# EAGLE schematic Stromlaufplan_3D-Drucker-Dominik_und_Sami_v5 (EAGLE 9.5.2)
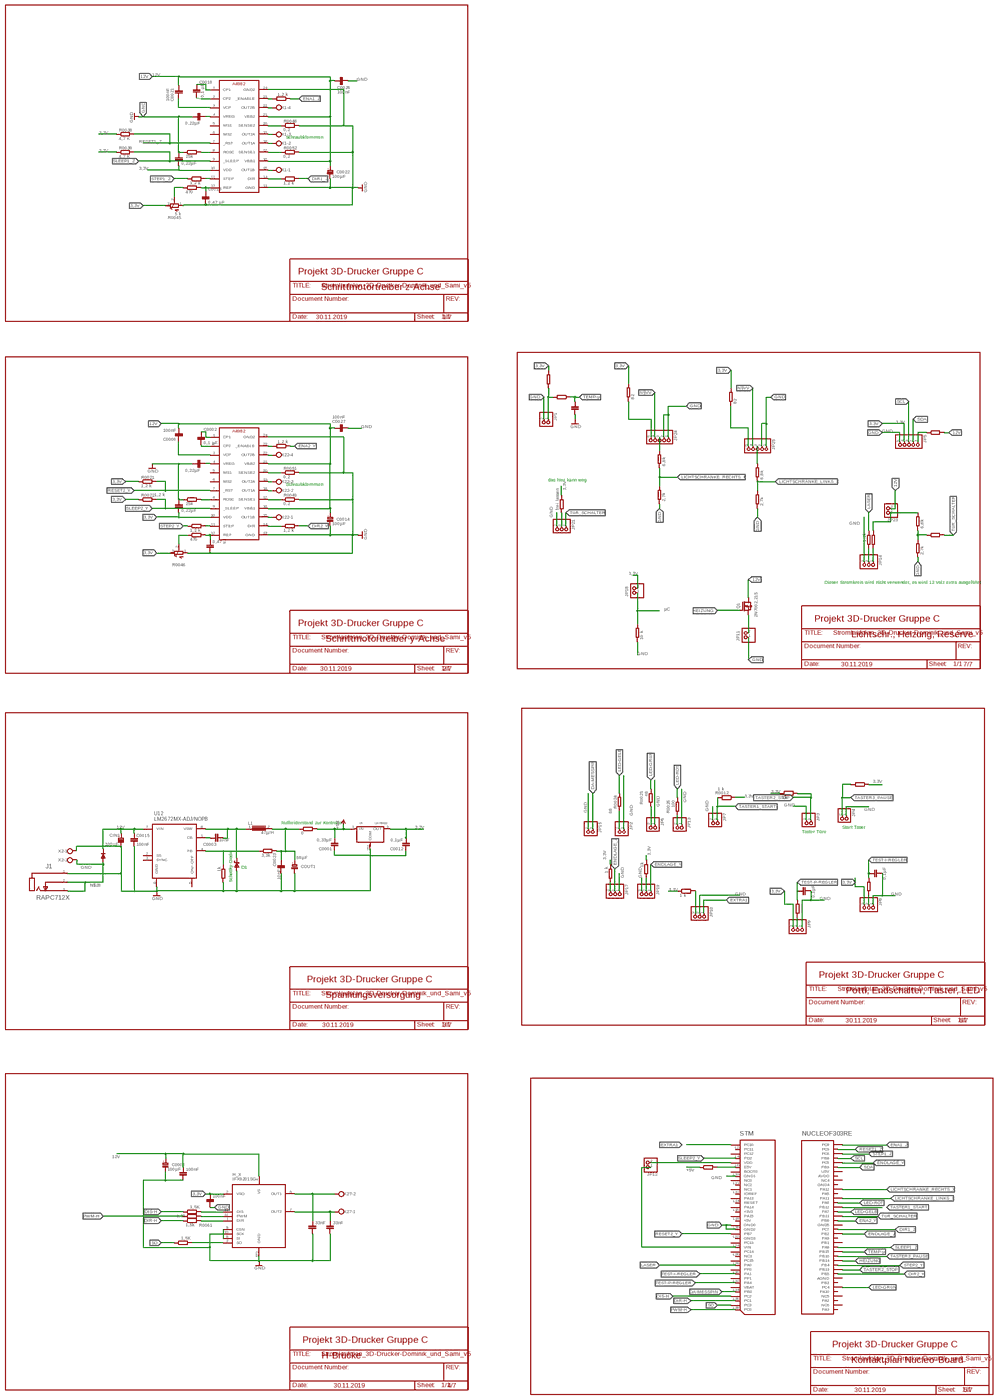
[diagram p0: schematic, sheet 1, overview]
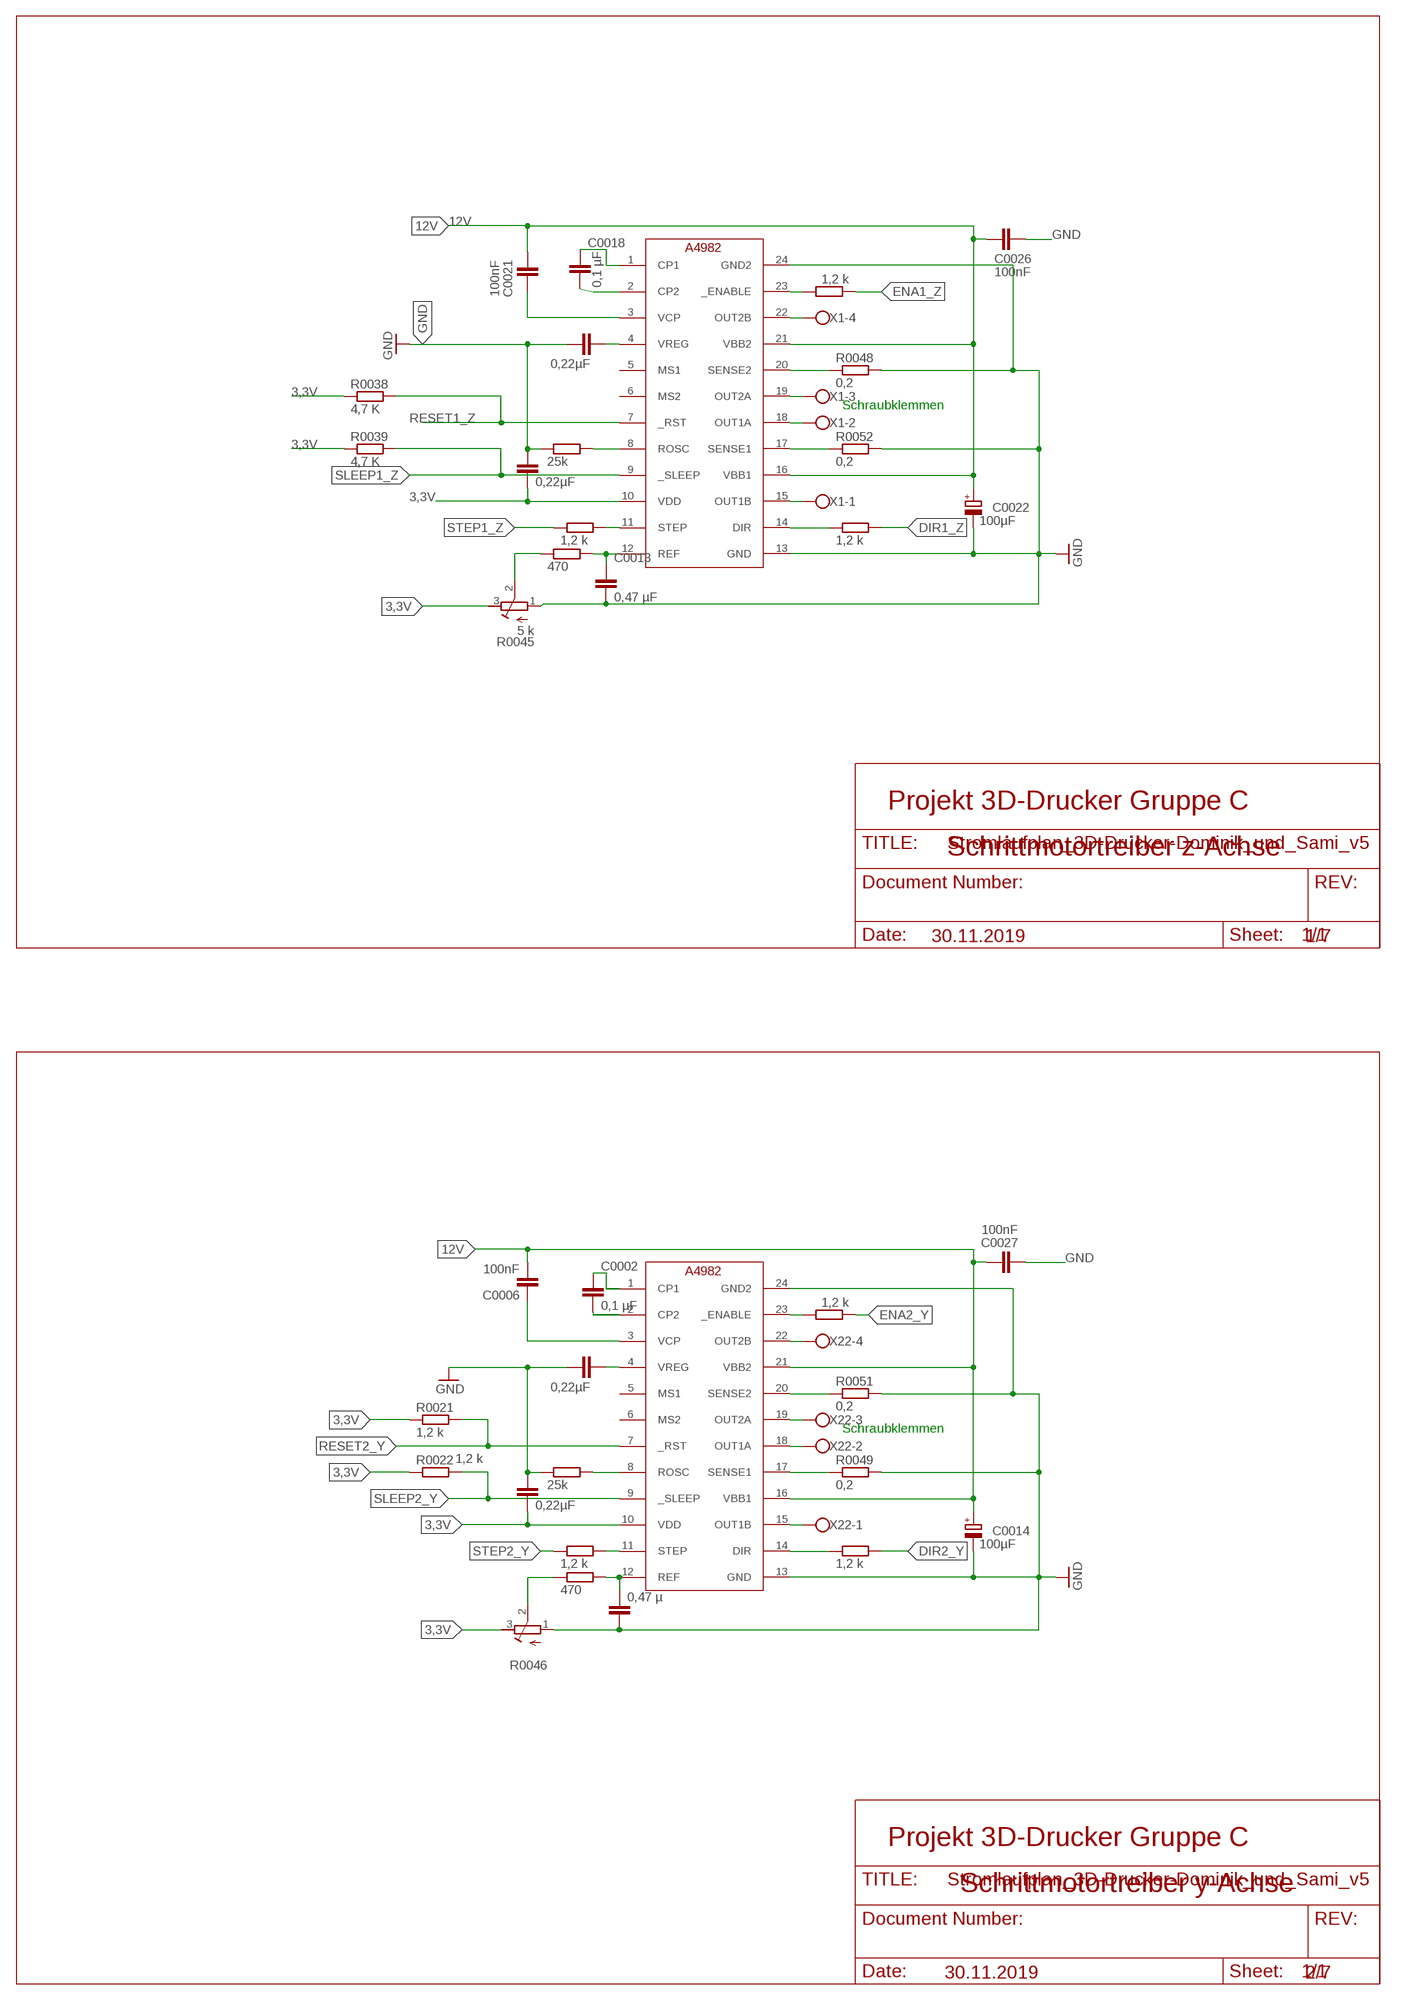
[diagram p1: schematic, sheet 1, part 1 of 4]
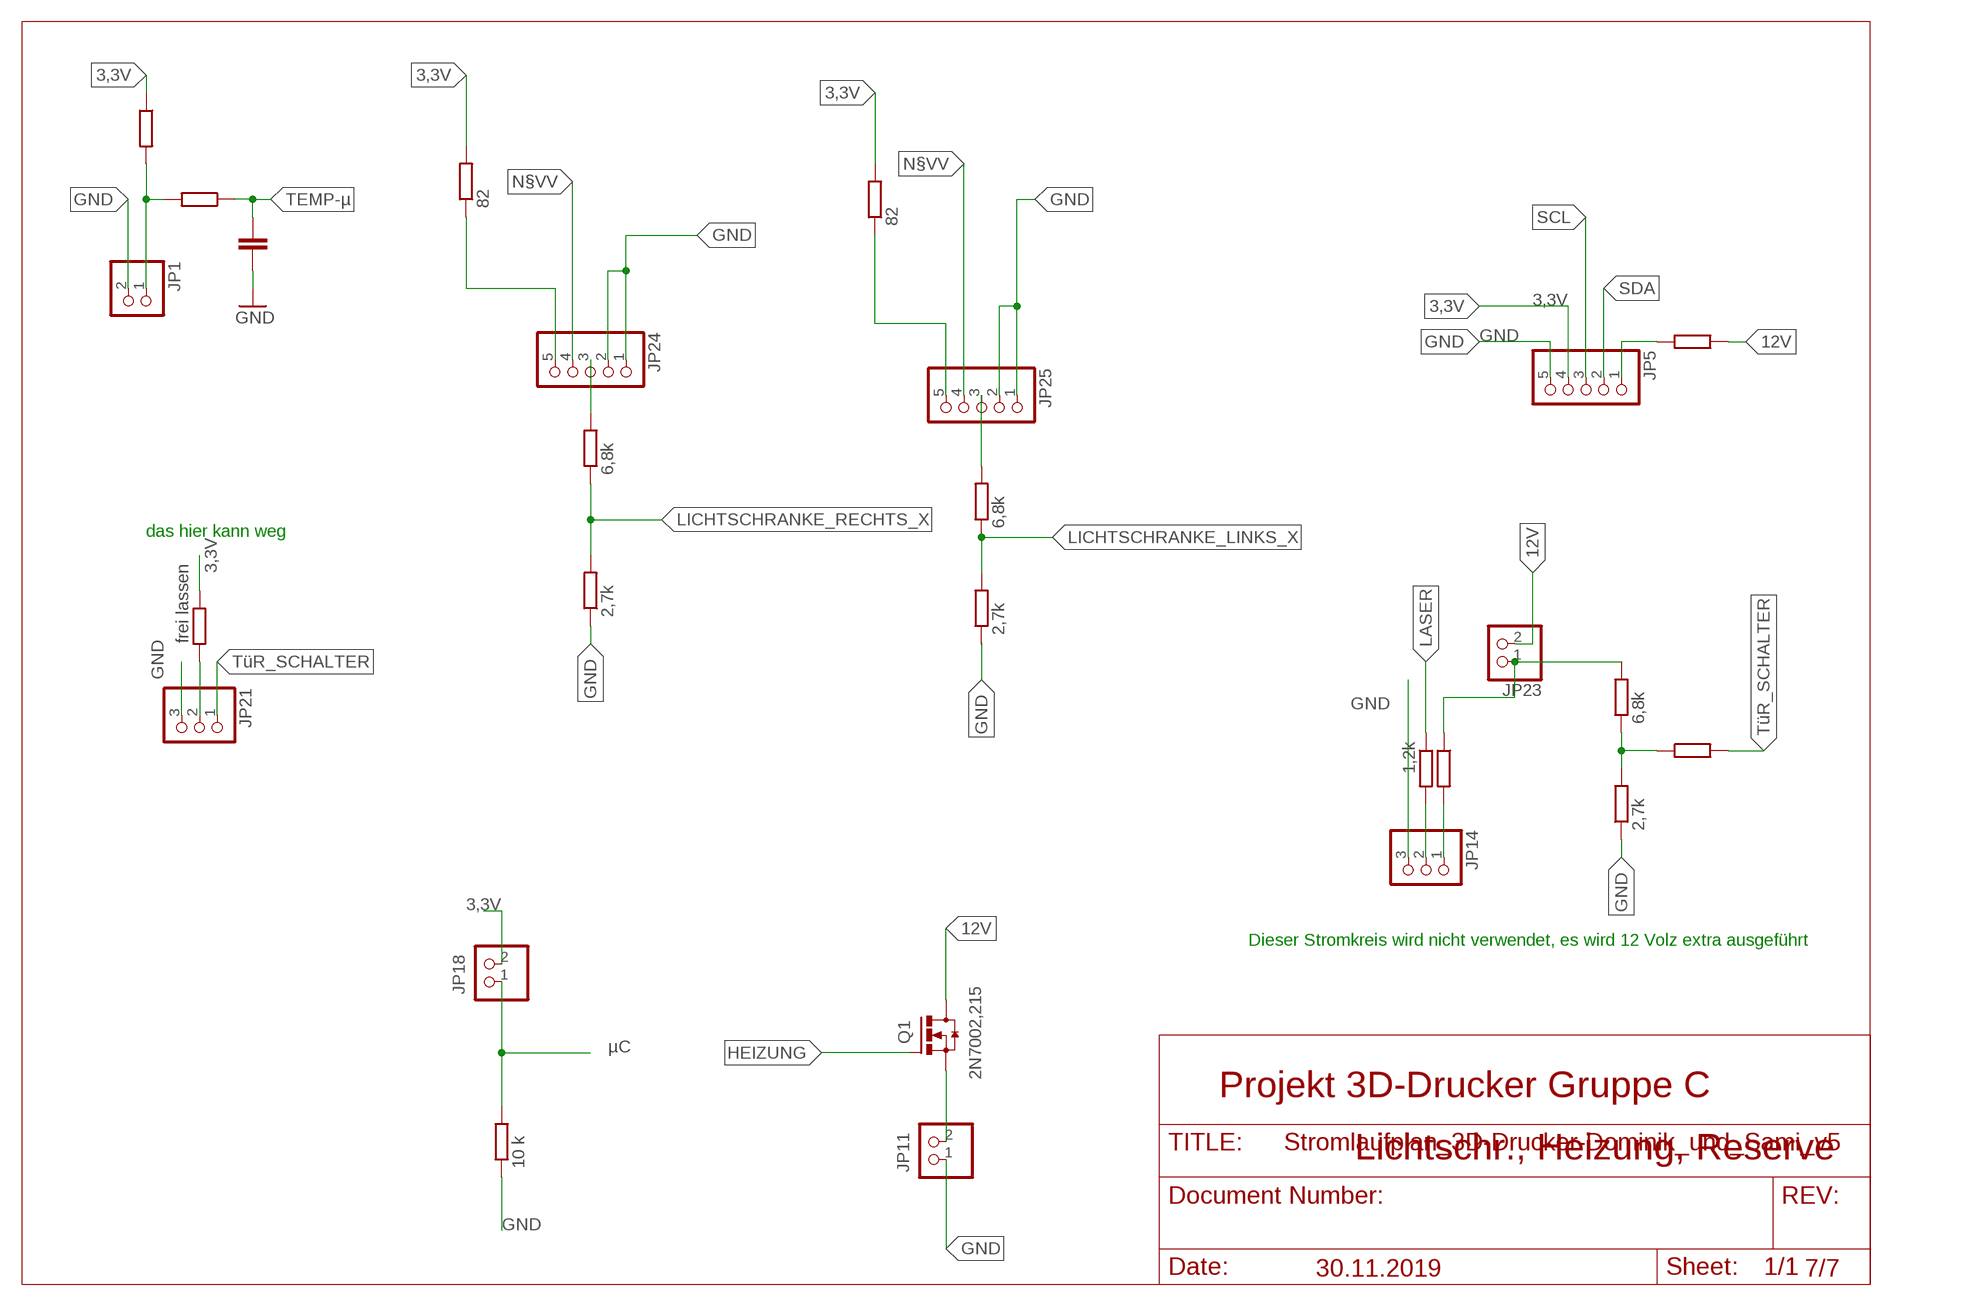
[diagram p2: schematic, sheet 1, part 2 of 4]
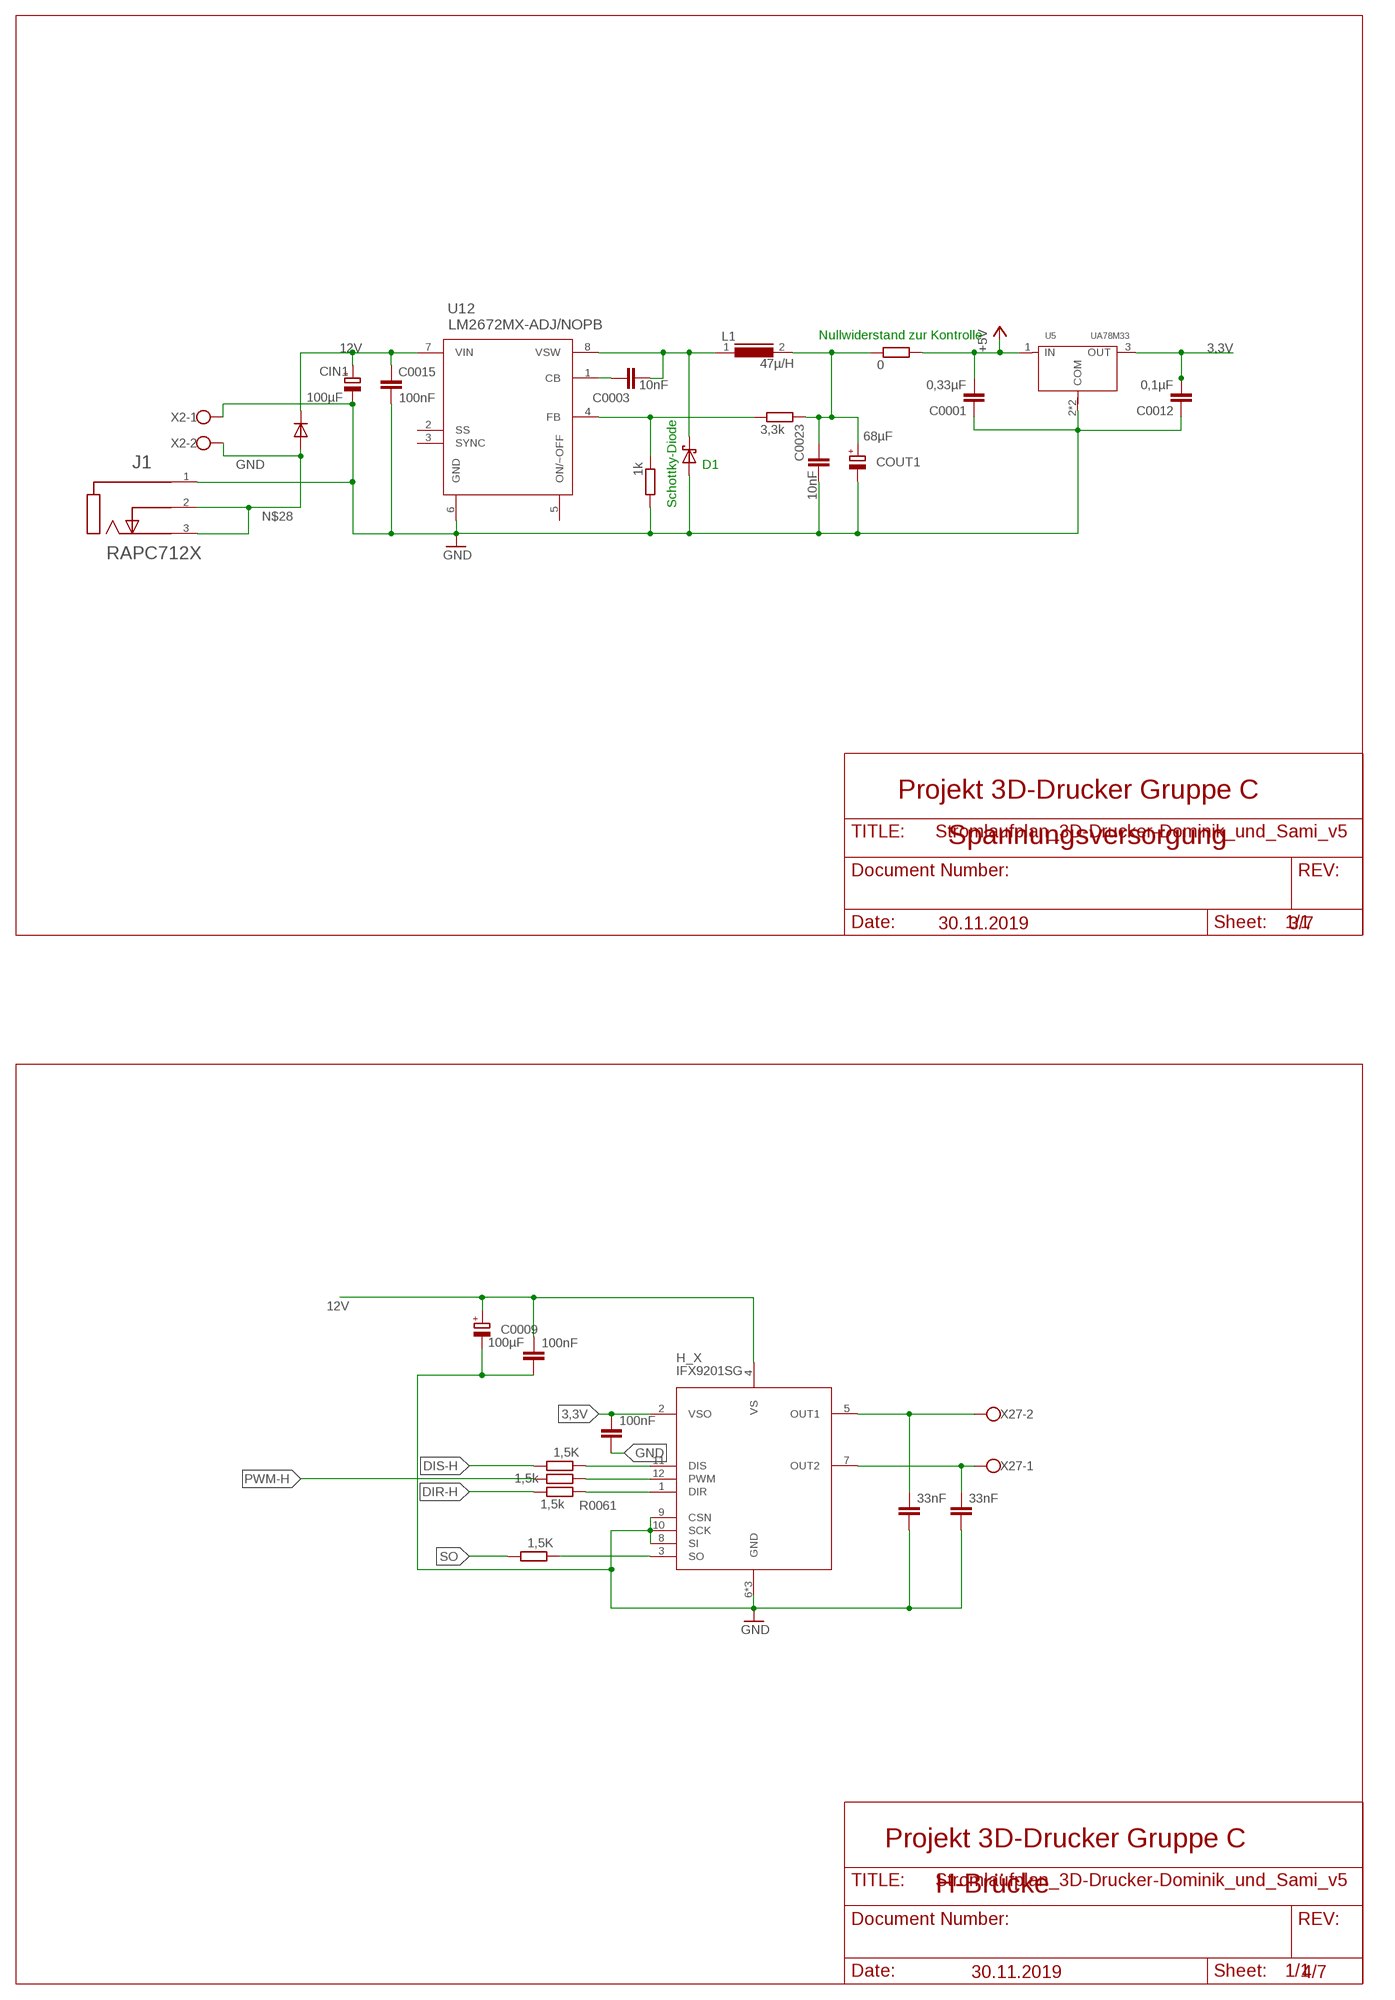
[diagram p3: schematic, sheet 1, part 3 of 4]
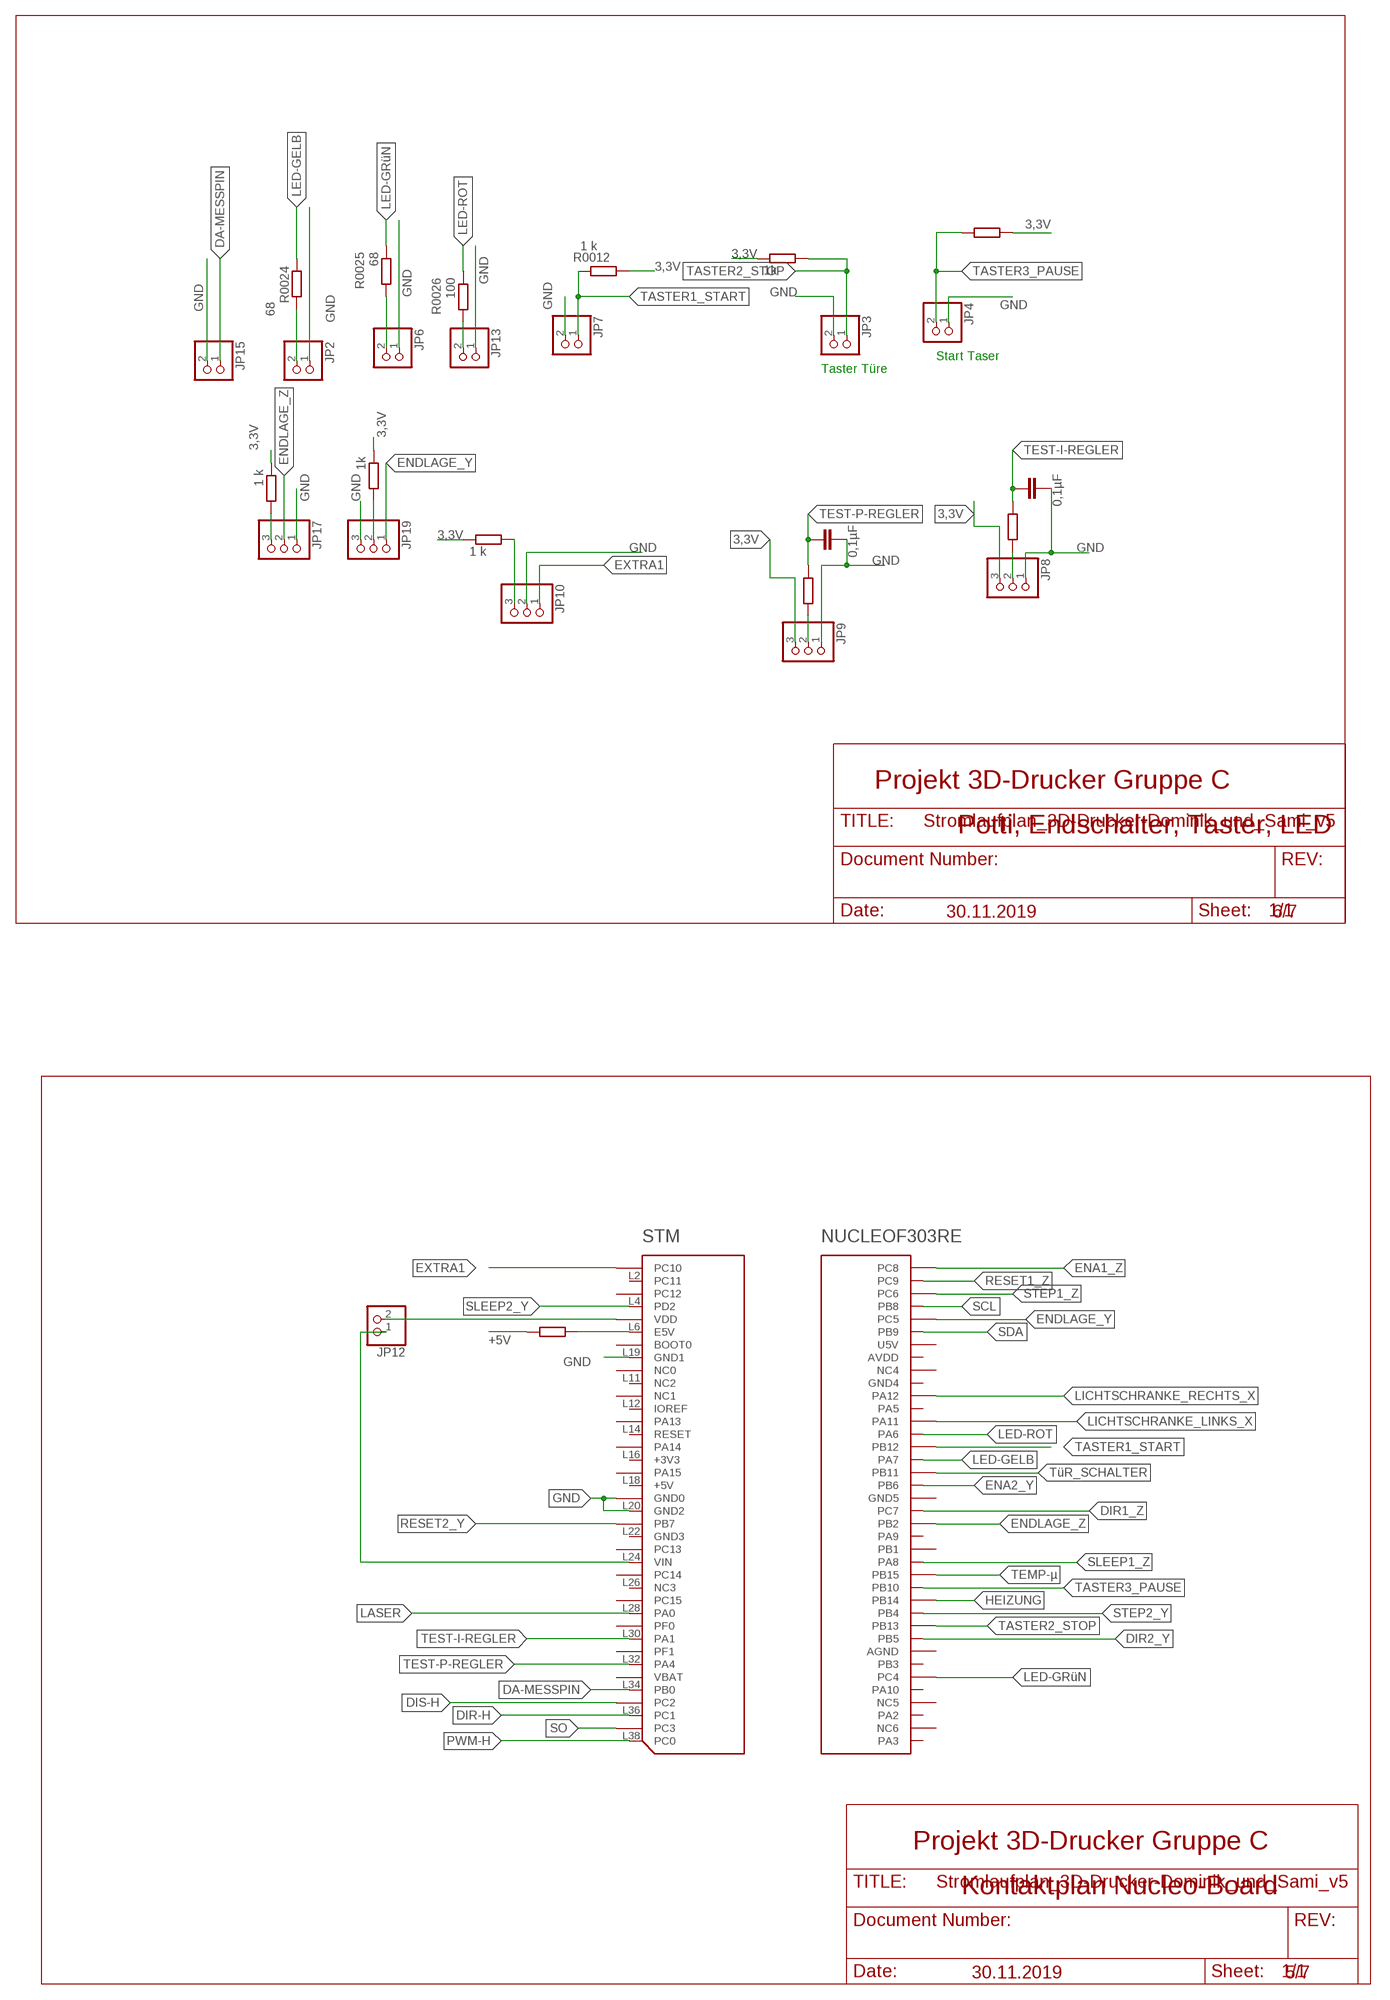
[diagram p4: schematic, sheet 1, part 4 of 4]

## Parts
A4982_Y  A4982_STEPDRIVER  [TSSOP24]
A4982_Y1  A4982_STEPDRIVER  [TSSOP24]
C0001  0,33µF  C-EUC0603  [C0603]
C0002  0,1 µF  C-EUC0603  [C0603]
C0003  10nF  C-EUC0603  [C0603]
C0004  0,22µF  C-EUC0603  [C0603]
C0005  0,22µF  C-EUC0603  [C0603]
C0006  100nF  C-EUC0603  [C0603]
C0007  33nF  C-EUC0805  [C0805]
C0008  33nF  C-EUC0805  [C0805]
C0009  100µF  CPOL-EUUD-8X10  [UD-8X10_NICHICON]
C0010  0,47 µ  C-EUC0805  [C0805]
C0011  C-EUC0805  [C0805]
C0012  0,1µF  C-EUC0603  [C0603]
C0013  0,47 µF  C-EUC0603  [C0603]
C0014  100µF  CPOL-EUUD-8X10  [UD-8X10_NICHICON]
C0015  100nF  C-EUC0603  [C0603]
C0016  100nF  C-EUC0805  [C0805]
C0018  0,1 µF  C-EUC0603  [C0603]
C0019  0,22µF  C-EUC0603  [C0603]
C0020  0,22µF  C-EUC0603  [C0603]
C0021  100nF  C-EUC0603  [C0603]
C0022  100µF  CPOL-EUUD-8X10  [UD-8X10_NICHICON]
C0023  10nF  C-EUC0603  [C0603]
C0024  0,1µF  C-EUC0603  [C0603]
C0025  0,1µF  C-EUC0603  [C0603]
C0026  100nF  C-EUC0603  [C0603]
C0027  100nF  C-EUC0603  [C0603]
C0041  100nF  C-EUC0805  [C0805]
CIN1  100µF  CPOL-EU140CLH-1010  [140CLH-1010]
COUT1  68µF  CPOL-EU140CLH-1010  [140CLH-1010]
D1  1N5819HW-7-F  [SOD-123_MINI-SMA]
D12  MURS360BT3G  [SMB]
H_X  IFX9201SG  [BSOP-12]
J1  RAPC712X  [SWC_RAPC712X]
JP1  PINHD-1X2  [1X02]
JP2  PINHD-1X2  [1X02]
JP3  PINHD-1X2  [1X02]
JP4  PINHD-1X2  [1X02]
JP5  PINHD-1X5  [1X05]
JP6  PINHD-1X2  [1X02]
JP7  PINHD-1X2  [1X02]
JP8  PINHD-1X3  [1X03]
JP9  PINHD-1X3  [1X03]
JP10  PINHD-1X3  [1X03]
JP11  PINHD-1X2  [1X02]
JP12  PINHD-1X2  [1X02]
JP13  PINHD-1X2  [1X02]
JP14  PINHD-1X3  [1X03]
JP15  PINHD-1X2  [1X02]
JP17  PINHD-1X3  [1X03]
JP18  PINHD-1X2  [1X02]
JP19  PINHD-1X3  [1X03]
JP21  PINHD-1X3  [1X03]
JP23  PINHD-1X2  [1X02]
JP24  PINHD-1X5  [1X05]
JP25  PINHD-1X5  [1X05]
L1  47µ/H  SRR1240-680M  [INDUCTOR]
Q1  2N7002,215  [SOT23-3]
R0001  1,5K  R-EU_R0603  [R0603]
R0002  6,8k  R-EU_R0603  [R0603]
R0003  1k  R-EU_R0603  [R0603]
R0004  2,7k  R-EU_R0603  [R0603]
R0005  6,8k  R-EU_R0603  [R0603]
R0006  25k  R-EU_R0603  [R0603]
R0007  10 k  R-EU_R0603  [R0603]
R0008  R-EU_R0603  [R0603]
R0009  1,2 k  R-EU_R0603  [R0603]
R0010  1,2 k  R-EU_R0603  [R0603]
R0011  1,2 k  R-EU_R0603  [R0603]
R0012  1 k  R-EU_R0603  [R0603]
R0013  1k  R-EU_R0603  [R0603]
R0014  R-EU_R0603  [R0603]
R0015  1 k  R-EU_R0603  [R0603]
R0016  R-EU_R0603  [R0603]
R0017  R-EU_R0603  [R0603]
R0018  frei lassen  R-EU_R0603  [R0603]
R0019  25k  R-EU_R0603  [R0603]
R0020  R-EU_R0603  [R0603]
R0021  1,2 k  R-EU_R0603  [R0603]
R0022  1,2 k  R-EU_R0603  [R0603]
R0023  470  R-EU_R0603  [R0603]
R0024  68  R-EU_R0603  [R0603]
R0025  68  R-EU_R0603  [R0603]
R0026  100  R-EU_R0603  [R0603]
R0027  R-EU_R0603  [R0603]
R0028  2,7k  R-EU_R0603  [R0603]
R0029  82  R-EU_R0603  [R0603]
R0030  R-EU_R0603  [R0603]
R0031  R-EU_R0603  [R0603]
R0032  82  R-EU_R0603  [R0603]
R0033  1 k  R-EU_R0603  [R0603]
R0034  1,2 k  R-EU_R0603  [R0603]
R0035  1,2 k  R-EU_R0603  [R0603]
R0036  1,2 k  R-EU_R0603  [R0603]
R0037  470  R-EU_R0603  [R0603]
R0038  4,7 K  R-EU_R0603  [R0603]
R0039  4,7 K  R-EU_R0603  [R0603]
R0042  1,2k  R-EU_R0603  [R0603]
R0043  6,8k  R-EU_R0603  [R0603]
R0044  2,7k  R-EU_R0603  [R0603]
R0045  5 k  R-TRIMM3296Y  [RTRIM3296Y]
R0046  R-TRIMM3296Y  [RTRIM3296Y]
R0048  0,2  R-EU_R2512  [R2512]
R0049  0,2  R-EU_R2512  [R2512]
R0051  0,2  R-EU_R2512  [R2512]
R0052  0,2  R-EU_R2512  [R2512]
R0053  R-EU_R0603  [R0603]
R0061  1,5k  R-EU_R0603  [R0603]
R0062  1,5k  R-EU_R0603  [R0603]
R0063  1,5K  R-EU_R0603  [R0603]
STM  NUCLEOF303RE  [DIL40]
TEST_R  0  R-EU_R0603  [R0603]
TEST_R2  3,3k  R-EU_R0603  [R0603]
TEST_R3  1k  R-EU_R0603  [R0603]
U5  UA78M33  [SOT-223]
U12  LM2672MX-ADJ/NOPB  [SOIC-8]
X1  SCHRAUBKLEMME_4X  [W237-4]
X2  SCHRAUBKLEMME_2X  [W237-102]
X22  SCHRAUBKLEMME_4X  [W237-4]
X27  SCHRAUBKLEMME_2X  [W237-102]

## Nets
3,3V [3,3V]: A4982_Y1.10(VDD) A4982_Y.10(VDD) C0005.1 C0012.2 C0016.1 C0020.1 H_X.2(VSO) JP5.4 JP8.3 JP9.3 JP18.2 R0003.1 R0008.1 R0012.1 R0013.1 R0014.1 R0015.1 R0018.1 R0021.1 R0022.1 R0029.2 R0032.2 R0033.1 R0038.1 R0039.1 R0045.3(E) R0046.3(E) U5.3(OUT)
12V [12V]: A4982_Y1.16(VBB1) A4982_Y1.21(VBB2) A4982_Y.16(VBB1) A4982_Y.21(VBB2) C0006.2 C0009.+ C0014.+ C0015.2 C0021.2 C0022.+ C0026.2 C0027.1 C0041.1 CIN1.+ D12.1 H_X.4(VS) JP14.1 JP23.2 Q1.3(D) R0016.2 R0030.2 U12.7(VIN)
+5V [5V]: C0001.2 R0027.1 TEST_R.2 U5.1(IN)
DA-MESSPIN: JP15.1 STM.L34(PB0)
DIR1_Z: R0036.2 STM.R19(PC7)
DIR2_Y: R0011.2 STM.R29(PB5)
DIR-H: R0061.1 STM.L36(PC1)
DIS-H: R0063.1 STM.L35(PC2)
ENA1_Z: R0034.1 STM.R2(PC8)
ENA2_Y: R0009.1 STM.R17(PB6)
ENDLAGE_Y: JP19.1 STM.R6(PC5)
ENDLAGE_Z: JP17.2 STM.R22(PB2)
EXTRA1: JP10.1 STM.L1(PC10)
GND [Ground]: A4982_Y1.13(GND) A4982_Y1.24(GND2) A4982_Y.13(GND) A4982_Y.24(GND2) C0001.1 C0004.2 C0005.2 C0007.2 C0008.2 C0009.- C0010.2 C0011.2 C0012.1 C0013.2 C0014.- C0015.1 C0016.2 C0019.2 C0020.2 C0022.- C0023.2 C0024.1 C0025.1 C0026.1 C0027.2 C0041.2 CIN1.- COUT1.- D1.A H_X.6(GND) H_X.8(SI) H_X.9(CSN) H_X.10(SCK) H_X.PAD2(GND) H_X.PAD(GND) J1.1(CENTER_PIN) JP1.2 JP2.1 JP3.2 JP4.1 JP5.5 JP6.1 JP7.2 JP8.1 JP9.1 JP10.2 JP11.1 JP13.1 JP14.3 JP15.2 JP17.1 JP19.3 JP21.3 JP24.1 JP24.2 JP25.1 JP25.2 R0004.1 R0006.1 R0007.1 R0019.1 R0028.1 R0044.1 R0045.1(A) R0046.1(A) R0048.2 R0049.2 R0051.2 R0052.2 STM.L8(GND0) STM.L19(GND1) STM.L20(GND2) TEST_R3.2 U5.2(COM) U5.TER(COM) U12.6(GND) X2.1
HEIZUNG: Q1.1(G) STM.R28(PB14)
LASER: R0042.1 STM.L28(PA0)
LED-GELB: R0024.2 STM.R15(PA7)
LED-GRüN: R0025.1 STM.R34(PC4)
LED-ROT: R0026.1 STM.R13(PA6)
LICHTSCHRANKE_LINKS_X: R0005.1 R0028.2 STM.R14(PA11)
LICHTSCHRANKE_RECHTS_X: R0002.1 R0004.2 STM.R12(PA12)
N$1: A4982_Y1.2(CP2) C0018.2
N$2: JP17.3 R0015.2
N$3: JP24.5 R0029.1
N$4: R0023.1 R0046.2(S)
N$5: C0003.1 U12.1(CB)
N$6: JP2.2 R0024.1
N$7: A4982_Y.12(REF) C0010.1 R0023.2
N$8: A4982_Y.2(CP2) C0002.2
N$9: A4982_Y.1(CP1) C0002.1
N$10: A4982_Y.3(VCP) C0006.1
N$11: JP19.2 R0003.2
N$12: A4982_Y.4(VREG) C0004.1
N$13: A4982_Y1.12(REF) C0013.1 R0037.2
N$14: A4982_Y1.1(CP1) C0018.1
N$15: A4982_Y.18(OUT1A) X22.2
N$16: A4982_Y.15(OUT1B) X22.1
N$17: A4982_Y.19(OUT2A) X22.3
N$18: A4982_Y.22(OUT2B) X22.4
N$19: A4982_Y.17(SENSE1) R0049.1
N$20: A4982_Y.20(SENSE2) R0051.1
N$21: A4982_Y.8(ROSC) R0006.2
N$22: A4982_Y.23(_ENABLE) R0009.2
N$23: H_X.3(SO) R0001.2
N$24: A4982_Y.14(DIR) R0011.1
N$25: A4982_Y1.4(VREG) C0019.1
N$26: A4982_Y1.15(OUT1B) X1.1
N$27: JP23.1 R0016.1 R0043.2
N$28: D12.2 J1.2(SHUNT) J1.3(SLEEVE) X2.2
N$29 [5V]: C0023.1 COUT1.+ L1.2 TEST_R2.2 TEST_R.1
N$30: A4982_Y1.19(OUT2A) X1.3
N$31: C0003.2 D1.C L1.1 U12.8(VSW)
N$32: JP9.2 R0031.1
N$33: JP24.3 R0002.2
N$34: JP25.3 R0005.2
N$35: R0017.1 R0043.1 R0044.2
N$36: JP8.2 R0053.1
N$37: A4982_Y1.22(OUT2B) X1.4
N$38: JP11.2 Q1.2(S)
N$39: A4982_Y1.17(SENSE1) R0052.1
N$40: JP6.2 R0025.2
N$41: JP13.2 R0026.2
N$42: A4982_Y1.20(SENSE2) R0048.1
N$43: A4982_Y1.8(ROSC) R0019.2
N$44: A4982_Y1.23(_ENABLE) R0034.2
N$45: H_X.1(DIR) R0061.2
N$46: H_X.12(PWM) R0062.2
N$47: C0007.1 H_X.5(OUT1) X27.2
N$48: JP5.1 R0030.1
N$49: A4982_Y1.14(DIR) R0036.1
N$50: JP25.5 R0032.1
N$51: JP10.3 R0033.2
N$52: JP14.2 R0042.2
N$53: JP1.1 R0008.2 R0020.2
N$54: A4982_Y1.18(OUT1A) X1.2
N$55: A4982_Y1.3(VCP) C0021.1
N$56: JP12.2 STM.L5(VDD)
N$57: R0037.1 R0045.2(S)
N$58: JP12.1 STM.L24(VIN)
N$59: R0027.2 STM.L6(E5V)
N$60: JP21.2 R0018.2
N$114: H_X.11(DIS) R0063.2
N$118: C0008.1 H_X.7(OUT2) X27.1
N§VV [5V]: JP24.4 JP25.4 TEST_R2.1 TEST_R3.1 U12.4(FB)
PWM-H: R0062.1 STM.L38(PC0)
RESET1_Z: A4982_Y1.7(_RST) R0038.2 STM.R1(PC9)
RESET2_Y: A4982_Y.7(_RST) R0021.2 STM.L21(PB7)
SCL: JP5.3 STM.R3(PB8)
SDA: JP5.2 STM.R5(PB9)
SLEEP1_Z: A4982_Y1.9(_SLEEP) R0039.2 STM.R23(PA8)
SLEEP2_Y: A4982_Y.9(_SLEEP) R0022.2 STM.L4(PD2)
SO: R0001.1 STM.L37(PC3)
STEP1_Z: R0035.1 STM.R4(PC6)
STEP2_Y: R0010.1 STM.R27(PB4)
STP1: A4982_Y.11(STEP) R0010.2
STP2: A4982_Y1.11(STEP) R0035.2
TASTER1_START: JP7.1 R0012.2 STM.R16(PB12)
TASTER2_STOP: JP3.1 R0013.2 STM.R30(PB13)
TASTER3_PAUSE: JP4.2 R0014.2 STM.R25(PB10)
TEMP-µ: C0011.1 R0020.1 STM.R26(PB15)
TEST-I-REGLER: C0025.2 R0053.2 STM.L30(PA1)
TEST-P-REGLER: C0024.2 R0031.2 STM.L32(PA4)
TüR_SCHALTER: JP21.1 R0017.2 STM.R18(PB11)
µC: JP18.1 R0007.2
Unconnected: A4982_Y1.5(MS1) A4982_Y1.6(MS2) A4982_Y.5(MS1) A4982_Y.6(MS2) STM.L2(PC11) STM.L3(PC12) STM.L7(BOOT0) STM.L9(NC0) STM.L10(NC1) STM.L11(NC2) STM.L12(IOREF) STM.L13(PA13) STM.L14(RESET) STM.L15(PA14) STM.L16(+3V3) STM.L17(PA15) STM.L18(+5V) STM.L22(GND3) STM.L23(PC13) STM.L25(PC14) STM.L26(NC3) STM.L27(PC15) STM.L29(PF0) STM.L31(PF1) STM.L33(VBAT) STM.R7(AVDD) STM.R8(U5V) STM.R9(GND4) STM.R10(NC4) STM.R11(PA5) STM.R20(GND5) STM.R21(PA9) STM.R24(PB1) STM.R31(PB3) STM.R32(AGND) STM.R33(PA10) STM.R35(PA2) STM.R36(NC5) STM.R37(PA3) STM.R38(NC6) U12.2(SS) U12.3(SYNC) U12.5(ON/~OFF)

## Notes on the sheet
- Schraubklemmen
- Projekt 3D-Drucker Gruppe C
- Schrittmotortreiber z-Achse
- 30.11.2019 | 1/7
- das hier kann weg
- Schraubklemmen
- Dieser Stromkreis wird nicht verwendet, es wird 12 Volz extra ausgeführt
- Projekt 3D-Drucker Gruppe C
- Projekt 3D-Drucker Gruppe C
- Lichtschr., Heizung, Reserve
- Schrittmotortreiber y-Achse
- 30.11.2019 | 7/7
- 30.11.2019 | 2/7
- Nullwiderstand zur Kontrolle
- Start Taser
- Taster Türe
- D1
- Schottky-Diode
- Projekt 3D-Drucker Gruppe C
- Projekt 3D-Drucker Gruppe C
- Potti, Endschalter, Taster, LED
- Spannungsversorgung
- 30.11.2019 | 6/7
- 30.11.2019 | 3/7
- Projekt 3D-Drucker Gruppe C
- Projekt 3D-Drucker Gruppe C
- H-Brücke
- Kontaktplan Nucleo-Board
- 30.11.2019 | 4/7
- 30.11.2019 | 5/7

## Library data of the parts
A4982_Y A4982_Y1 = 181012 Stepdriver:A4982_STEPDRIVER
C0001-C0008 C0010-C0013 C0015 C0016 C0018-C0021 C0023-C0027 C0041 = rcl:C-EU: CAPACITOR, European symbol; SPICEPREFIX: C
C0009 C0014 C0022 CIN1 COUT1 = rcl:CPOL-EU: POLARIZED CAPACITOR, European symbol; SPICEPREFIX: C
D1 = 181004 AMS_MIMS_1819:1N5819HW-7-F
D12 = 181004 AMS_MIMS_1819:MURS360BT3G
H_X = 181004 AMS_MIMS_1819:IFX9201SG
J1 = RAPC712X:RAPC712X: Conn; AV; Power; Jack; Mini; 2.5mmPinDia; RtAngle; Thru-hole; for760, 765Plug; AVAILABILITY: Unavailable; DESCRIPTION: Conn Power PL 2 POS Solder RA Thru-Hole 3 Terminal 1 Port Bulk; MF: Switchcraft; MP: RAPC712X; PACKAGE: None; PRICE: None
JP1-JP4 JP6 JP7 JP11-JP13 JP15 JP18 JP23 = pinhead:PINHD-1X2: PIN HEADER
JP5 JP24 JP25 = pinhead:PINHD-1X5: PIN HEADER
JP8-JP10 JP14 JP17 JP19 JP21 = pinhead:PINHD-1X3: PIN HEADER
L1 = 181004 AMS_MIMS_1819:SRR1240-680M
Q1 = Transistor:2N7002,215: MOSFET N-CH 60V 300MA SOT-23 Manufacturer's datasheet <https://assets.nexperia.com/documents/data-sheet/2N7002.pdf>; CREATED_BY: PCBLayout.com; DIGIKEY_PART_NUMBER: 1727-2764-1-ND; MANUFACTURER: Nexperia USA Inc.; MPN: 2N7002,215; PACKAGE: SOT-23-3
R0001-R0009 R0010-R0039 R0042-R0044 R0048 R0049 R0051-R0053 R0061-R0063 TEST_R TEST_R2 TEST_R3 = rcl:R-EU_: RESISTOR, European symbol; SPICEPREFIX: R
R0045 R0046 = rcl:R-TRIMM: Trimm resistor; SPICEMODEL: X; SPICEPREFIXL: POT
STM = NUCLEOF303RE:NUCLEOF303RE
U5 = 181004 AMS_MIMS_1819:UA78M33: 310030270; AVAILABILITY: Unavailable; DESCRIPTION: 3/4 Pin 500mA Fixed 3.3V Positive Voltage Regulator 4-SOT-223 0 to 125; MF: Texas Instruments; MP: UA78M33CDCYR; PACKAGE: SOT-223-4 Texas Instruments; PRICE: None
U12 = 181004 AMS_MIMS_1819:LM2672MX-ADJ/NOPB: Step-Down Voltage Regulator; AVAILABILITY: Unavailable; DESCRIPTION: SIMPLE SWITCHER® 6.5V to 40V, 1A Low Component Count Step-Down Regulator 8-SOIC -40 to 125; MF: Texas Instruments; MP: LM2672MX-ADJ/NOPB; PACKAGE: SOIC-8 Texas Instruments; PRICE: None
X1 X22 = 181004 AMS_MIMS_1819:SCHRAUBKLEMME_4X: WAGO SCREW CLAMP; OC_FARNELL: unknown; OC_NEWARK: unknown
X2 X27 = 181004 AMS_MIMS_1819:SCHRAUBKLEMME_2X: WAGO SCREW CLAMP; MPN: 237-102; OC_FARNELL: unknown; OC_NEWARK: 70K9898

## Net classes
0 default: width 0.3 mm, drill 0.4 mm, clearance 0.3 mm
1 Ground: width 0.3 mm
2 12V: width 0.3 mm
3 5V: width 0.3 mm
4 3,3V: width 0.3 mm